# EAGLE design Handy_sense_v_1.0.0 (EAGLE 9.2.0)
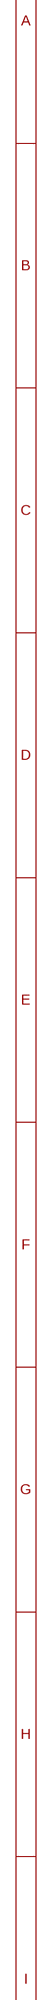
[diagram p0: schematic, sheet 1, part 1 of 2]
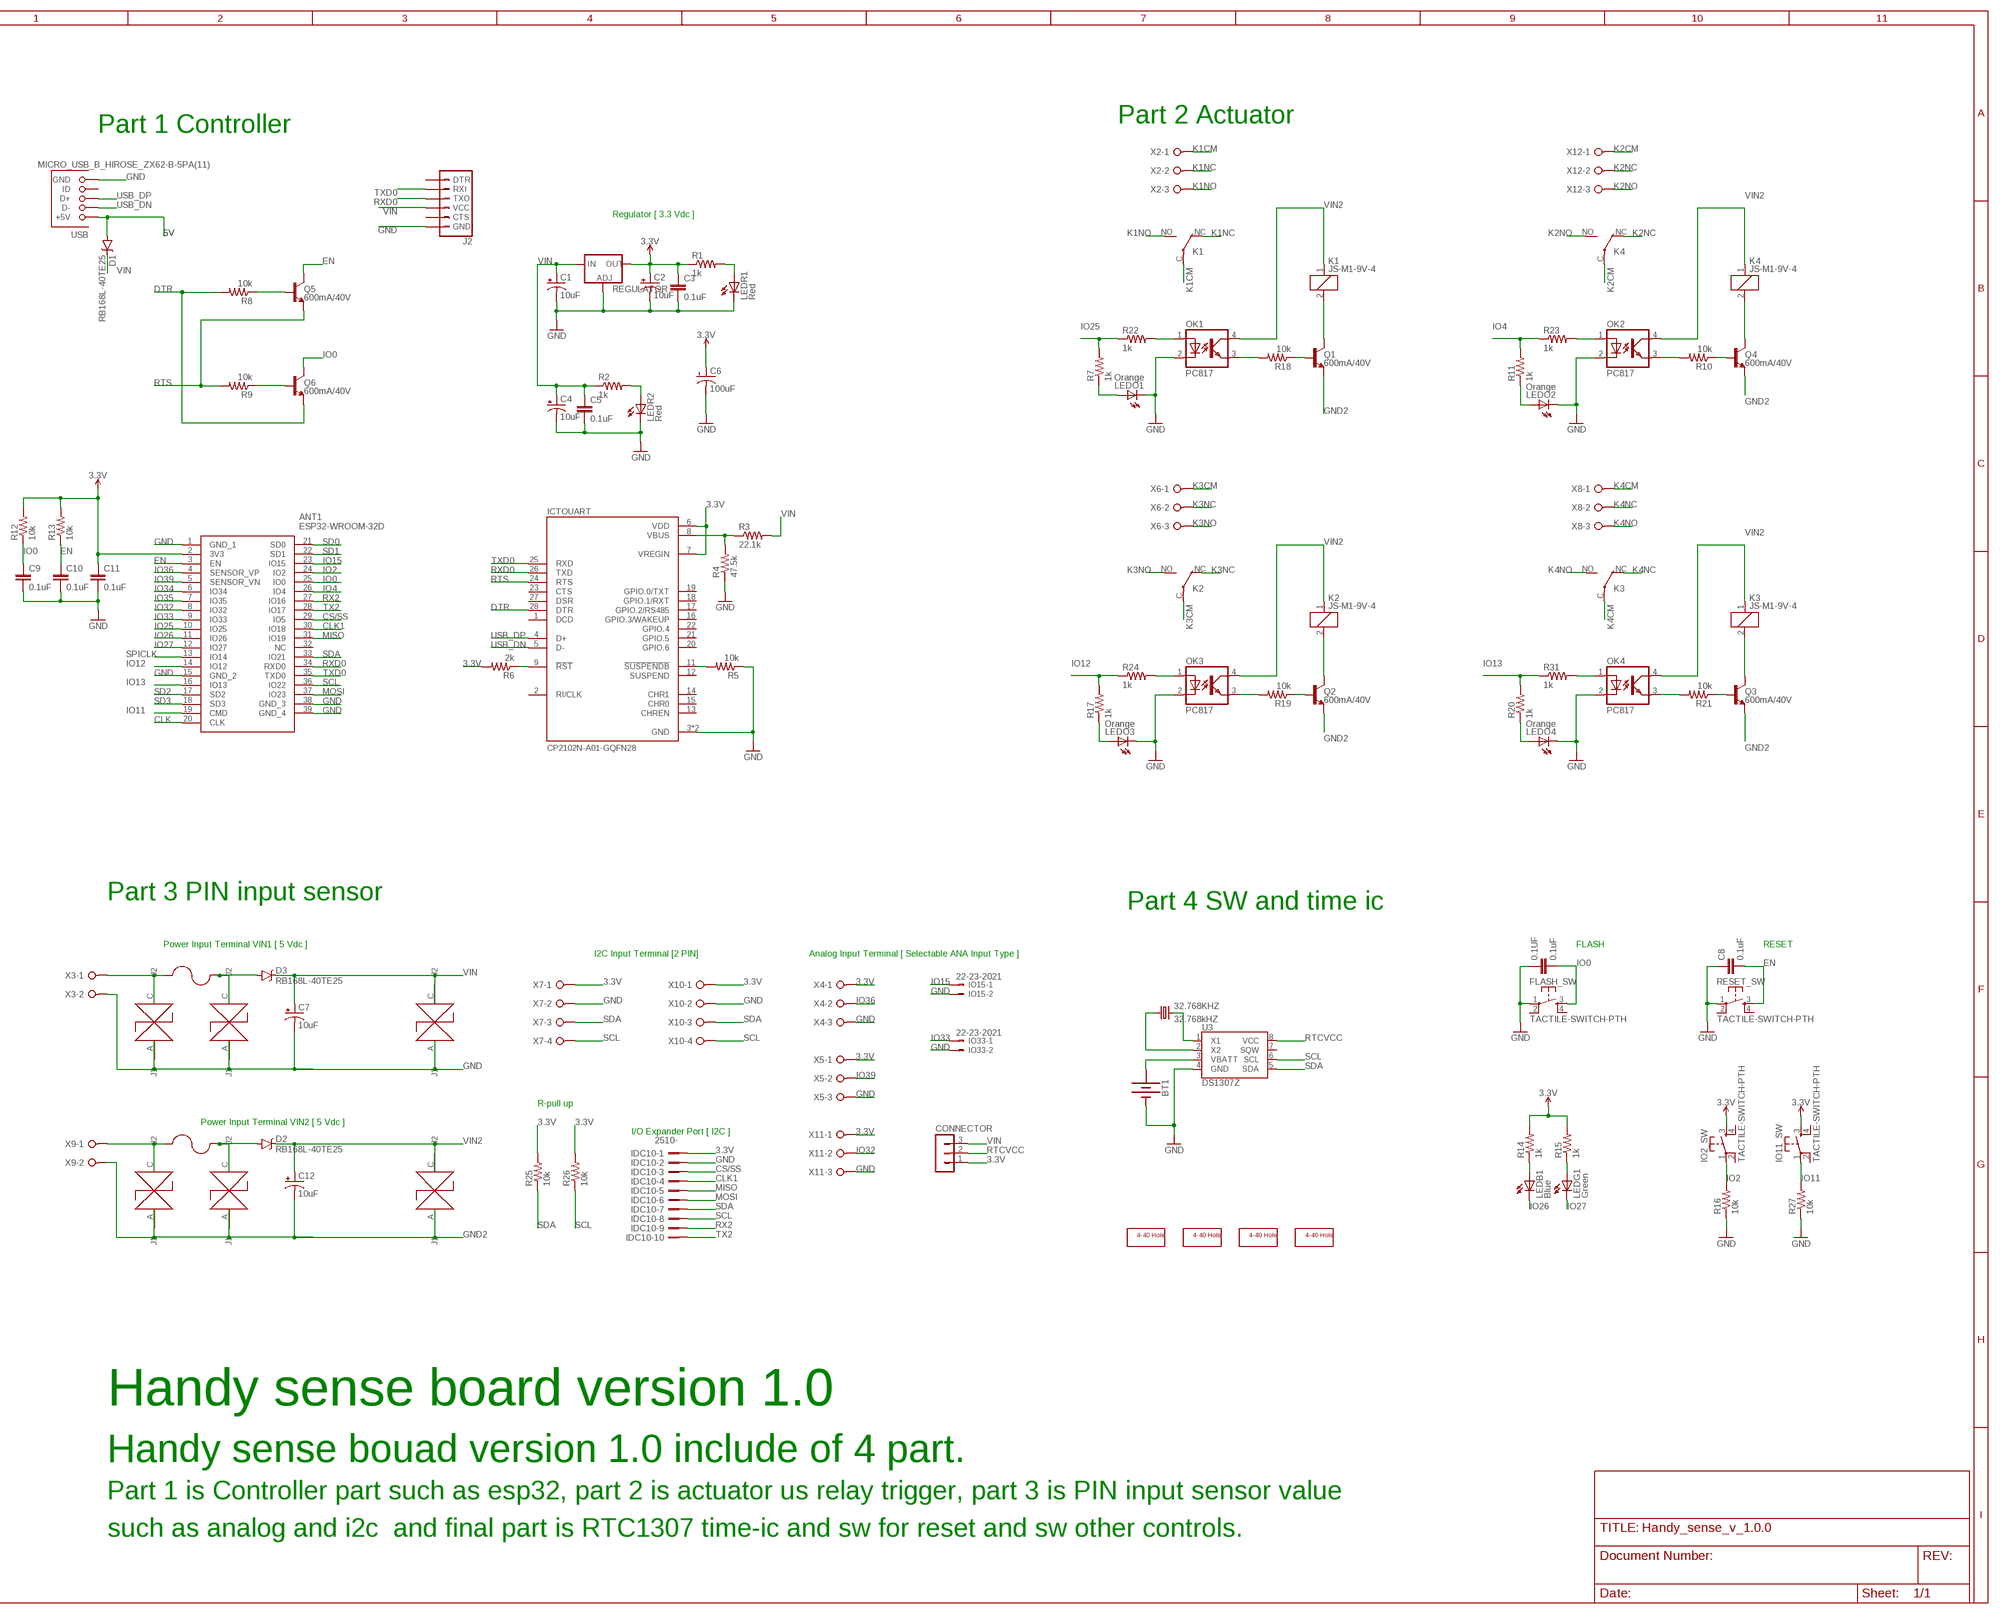
[diagram p1: schematic, sheet 1, part 2 of 2]

## Parts
0.1UF  0.1uF  CAP0805  [0805]
32.768KHZ  32.768kHZ  CRYSTALTC26H  [TC26H]
ANT1  ESP32-WROOM-32D  [ESP32WROOM32D]
BT1  BATTERY-20MM_PTH_KIT  [BATTCOM_20MM_PTH_KIT]
C1  10uF  10UF-16V-10%(TANT)  [EIA3216]
C2  10uF  10UF-16V-10%(TANT)  [EIA3216]
C3  0.1uF  CAP0805  [0805]
C4  10uF  10UF-16V-10%(TANT)  [EIA3216]
C5  0.1uF  CAP0805  [0805]
C6  100uF  100UF-POLAR-EIA7343-16V-10%(TANT)  [EIA7343]
C7  10uF  10UF-16V-10%(TANT)  [EIA3216]
C8  0.1uF  CAP0805  [0805]
C9  0.1uF  CAP0805  [0805]
C10  0.1uF  CAP0805  [0805]
C11  0.1uF  CAP0805  [0805]
C12  10uF  10UF-16V-10%(TANT)  [EIA3216]
CONNECTOR  MA03-1  [MA03-1]
D1  RB168L-40TE25  DIODE-SCHOTTKY-MBRA140  [SMA-DIODE]
D2  RB168L-40TE25  DIODE-SCHOTTKY-MBRA140  [SMA-DIODE]
D3  RB168L-40TE25  DIODE-SCHOTTKY-MBRA140  [SMA-DIODE]
FLASH_SW  TACTILE-SWITCH-PTH  [TAC-SWITCH-PTH]
HOLE0  SCREW_HOLE_4-40  [SCREW_HOLE_4-40]
HOLE1  SCREW_HOLE_4-40  [SCREW_HOLE_4-40]
HOLE2  SCREW_HOLE_4-40  [SCREW_HOLE_4-40]
HOLE3  SCREW_HOLE_4-40  [SCREW_HOLE_4-40]
ICTOUART  CP2102N-A01-GQFN28  [QFN50P500X500X80-29N]
IDC10  2510-  [PAK100/2500-10]
IO2_SW  TACTILE-SWITCH-PTH  [TAC-SWITCH-PTH]
IO11_SW  TACTILE-SWITCH-PTH  [TAC-SWITCH-PTH]
IO15  22-23-2021  [22-23-2021]
IO33  22-23-2021  [22-23-2021]
J2  6_PIN_SERIAL_TARGET_SILK  [1X06]
J28CA1  SMBJ28CA  [DIOM505270X240]
J28CA2  SMBJ28CA  [DIOM505270X240]
J28CA3  SMBJ28CA  [DIOM505270X240]
J28CA4  SMBJ28CA  [DIOM505270X240]
J28CA5  SMBJ28CA  [DIOM505270X240]
J28CA6  SMBJ28CA  [DIOM505270X240]
K1  JS-M1-9V-4  [JS-M]
K2  JS-M1-9V-4  [JS-M]
K3  JS-M1-9V-4  [JS-M]
K4  JS-M1-9V-4  [JS-M]
LEDB1  Blue  LEDCHIPLED_0805  [CHIPLED_0805]
LEDG1  Green  LEDCHIPLED_0805  [CHIPLED_0805]
LEDO1  Orange  LEDCHIPLED_0805  [CHIPLED_0805]
LEDO2  Orange  LEDCHIPLED_0805  [CHIPLED_0805]
LEDO3  Orange  LEDCHIPLED_0805  [CHIPLED_0805]
LEDO4  Orange  LEDCHIPLED_0805  [CHIPLED_0805]
LEDR1  Red  LEDCHIPLED_0805  [CHIPLED_0805]
LEDR2  Red  LEDCHIPLED_0805  [CHIPLED_0805]
OK1  PC817  [DIL04]
OK2  PC817  [DIL04]
OK3  PC817  [DIL04]
OK4  PC817  [DIL04]
Q1  600mA/40V  TRANS_NPN-MMBT2222AL  [SOT23-3]
Q2  600mA/40V  TRANS_NPN-MMBT2222AL  [SOT23-3]
Q3  600mA/40V  TRANS_NPN-MMBT2222AL  [SOT23-3]
Q4  600mA/40V  TRANS_NPN-MMBT2222AL  [SOT23-3]
Q5  600mA/40V  TRANS_NPN-MMBT2222AL  [SOT23-3]
Q6  600mA/40V  TRANS_NPN-MMBT2222AL  [SOT23-3]
R1  1k  R-US_R0805  [R0805]
R2  1k  R-US_R0805  [R0805]
R3  22.1k  R-US_R0805  [R0805]
R4  47.5k  R-US_R0805  [R0805]
R5  10k  R-US_R0805  [R0805]
R6  2k  R-US_R0805  [R0805]
R7  1k  R-US_R0805  [R0805]
R8  10k  R-US_R0805  [R0805]
R9  10k  R-US_R0805  [R0805]
R10  10k  R-US_R0805  [R0805]
R11  1k  R-US_R0805  [R0805]
R12  10k  R-US_R0805  [R0805]
R13  10k  R-US_R0805  [R0805]
R14  1k  R-US_R0805  [R0805]
R15  1k  R-US_R0805  [R0805]
R16  10k  R-US_R0805  [R0805]
R17  1k  R-US_R0805  [R0805]
R18  10k  R-US_R0805  [R0805]
R19  10k  R-US_R0805  [R0805]
R20  1k  R-US_R0805  [R0805]
R21  10k  R-US_R0805  [R0805]
R22  1k  R-US_R0805  [R0805]
R23  1k  R-US_R0805  [R0805]
R24  1k  R-US_R0805  [R0805]
R25  10k  R-US_R0805  [R0805]
R26  10k  R-US_R0805  [R0805]
R27  10k  R-US_R0805  [R0805]
R31  1k  R-US_R0805  [R0805]
REGULATOR  V_REG_LM1117SOT223  [SOT223]
RESET_SW  TACTILE-SWITCH-PTH  [TAC-SWITCH-PTH]
U3  DS1307Z  [SO08-0.15]
U$1  MSMFF2602  [FUSE_MF-MSMF260-2]
U$2  MSMFF2602  [FUSE_MF-MSMF260-2]
USB  MICRO_USB_B_HIROSE_ZX62-B-5PA(11)  [USB_MICRO_B-HIROSE-ZX62-B-5PA(11)]
X2  W237-03P  [W237-133]
X3  W237-02P  [W237-132]
X4  W237-03P  [W237-133]
X5  W237-03P  [W237-133]
X6  W237-03P  [W237-133]
X7  W237-04P  [W237-4P]
X8  W237-03P  [W237-133]
X9  W237-02P  [W237-132]
X10  W237-04P  [W237-4P]
X11  W237-03P  [W237-133]
X12  W237-03P  [W237-133]

## Nets
3.3V [etc]: ANT1.2(3V3) C2.A(+) C3.1 C6.A(+) C11.1 CONNECTOR.1 ICTOUART.6(VDD) ICTOUART.7(VREGIN) IDC10.1 IO2_SW.3 IO11_SW.3 R1.1 R6.2 R12.2 R13.2 R14.2 R15.2 R25.2 R26.2 REGULATOR.2(OUT) REGULATOR.4(OUT) X4.1 X5.1 X7.1 X10.1 X11.1
5V: D1.A USB.1(+5V)
CLK: ANT1.20(CLK)
CLK1 [spi]: ANT1.30(IO18) IDC10.4
CS/SS [spi]: ANT1.29(IO5) IDC10.3
DTR: ICTOUART.28(DTR) Q6.2(E) R8.2
EN: ANT1.3(EN) C8.2 C10.1 Q5.3(C) R13.1 RESET_SW.3
GND [etc]: 0.1UF.1 ANT1.1(GND_1) ANT1.15(GND_2) ANT1.38(GND_3) ANT1.39(GND_4) BT1.2(-) C1.C(-) C2.C(-) C3.2 C4.C(-) C5.2 C6.C(-) C7.C(-) C8.1 C9.2 C10.2 C11.2 FLASH_SW.1 ICTOUART.3(GND) ICTOUART.29(GND) IDC10.2 IO15.2 IO33.2 J2.6(GND) J28CA1.A(J1) J28CA2.A(J1) J28CA3.A(J1) LEDO1.C LEDO2.C LEDO3.C LEDO4.C LEDR1.C LEDR2.C OK1.2(C) OK2.2(C) OK3.2(C) OK4.2(C) R4.1 R5.1 R16.1 R27.1 REGULATOR.1(ADJ) RESET_SW.1 U3.4(GND) USB.5(GND) X3.2 X4.3 X5.3 X7.2 X10.2 X11.3
GND2 [etc]: C12.C(-) J28CA4.A(J1) J28CA5.A(J1) J28CA6.A(J1) Q1.2(E) Q2.2(E) Q3.2(E) Q4.2(E) X9.2
IO0: 0.1UF.2 ANT1.25(IO0) C9.1 FLASH_SW.3 Q6.3(C) R12.1
IO2 [etc]: ANT1.24(IO2) IO2_SW.1 R16.2
IO4: ANT1.26(IO4) R11.2 R23.1
IO11 [etc]: ANT1.19(CMD) IO11_SW.1 R27.2
IO12 [spi]: ANT1.14(IO12) R17.2 R24.1
IO13 [spi]: ANT1.16(IO13) R20.2 R31.1
IO15 [spi]: ANT1.23(IO15) IO15.1
IO25: ANT1.10(IO25) R7.2 R22.1
IO26: ANT1.11(IO26) LEDB1.C
IO27: ANT1.12(IO27) LEDG1.C
IO32: ANT1.8(IO32) X11.2
IO33: ANT1.9(IO33) IO33.1
IO34: ANT1.6(IO34)
IO35: ANT1.7(IO35)
IO36 [etc]: ANT1.4(SENSOR_VP) X4.2
IO39: ANT1.5(SENSOR_VN) X5.2
K1CM: K1.C(2:P) X2.1
K1NC: K1.NC(2:O) X2.2
K1NO: K1.NO(2:S) X2.3
K2CM: K4.C(2:P) X12.1
K2NC: K4.NC(2:O) X12.2
K2NO: K4.NO(2:S) X12.3
K3CM: K2.C(2:P) X6.1
K3NC: K2.NC(2:O) X6.2
K3NO: K2.NO(2:S) X6.3
K4CM: K3.C(2:P) X8.1
K4NC: K3.NC(2:O) X8.2
K4NO: K3.NO(2:S) X8.3
MISO [spi]: ANT1.31(IO19) IDC10.5
MOSI [spi]: ANT1.37(IO23) IDC10.6
N$1: K1.2 Q1.3(C)
N$2: ICTOUART.9(!RST) R6.1
N$3: ICTOUART.8(VBUS) R3.1 R4.2
N$4: LEDR2.A R2.2
N$5: Q4.1(B) R10.1
N$6: ICTOUART.11(!SUSPENDB) R5.2
N$7: Q5.1(B) R8.1
N$8: Q1.1(B) R18.1
N$9: Q2.1(B) R19.1
N$10: Q6.1(B) R9.1
N$11: OK3.3(EMIT) R19.2
N$12: OK1.3(EMIT) R18.2
N$13: 32.768KHZ.2 U3.1(X1)
N$14: LEDB1.A R14.1
N$15: LEDR1.A R1.2
N$16: K2.2 Q2.3(C)
N$17: 32.768KHZ.1 U3.2(X2)
N$18: BT1.1(+) U3.3(VBATT)
N$19: LEDG1.A R15.1
N$20 [IO]: LEDO2.A R11.1
N$21: OK2.3(EMIT) R10.2
N$22 [IO]: LEDO3.A R17.1
N$23: K4.2 Q4.3(C)
N$24: Q3.1(B) R21.1
N$25 [IO]: LEDO4.A R20.1
N$26: OK4.3(EMIT) R21.2
N$27: K3.2 Q3.3(C)
N$28 [5cdv]: J28CA1.C(J2) U$1.1 X3.1
N$29: OK1.1(A) R22.2
N$30: OK3.1(A) R24.2
N$31: OK2.1(A) R23.2
N$32: OK4.1(A) R31.2
N$33 [5cdv]: LEDO1.A R7.1
N$34 [5cdv]: D3.A J28CA2.C(J2) U$1.2
N$35 [5cdv]: J28CA4.C(J2) U$2.1 X9.1
N$37 [5cdv]: D2.A J28CA5.C(J2) U$2.2
RTCVCC [spi]: CONNECTOR.2 U3.8(VCC)
RTS: ICTOUART.24(RTS) Q5.2(E) R9.2
RX2 [spi]: ANT1.27(IO16) IDC10.9
RXD0: ANT1.34(RXD0) ICTOUART.26(TXD) J2.3(TXO)
SCL [etc]: ANT1.36(IO22) IDC10.8 R26.1 U3.6(SCL) X7.4 X10.4
SD0: ANT1.21(SD0)
SD1: ANT1.22(SD1)
SD2: ANT1.17(SD2)
SD3: ANT1.18(SD3)
SDA [etc]: ANT1.33(IO21) IDC10.7 R25.1 U3.5(SDA) X7.3 X10.3
SPICLK: ANT1.13(IO14)
TX2 [spi]: ANT1.28(IO17) IDC10.10
TXD0: ANT1.35(TXD0) ICTOUART.25(RXD) J2.2(RXI)
USB_DN: ICTOUART.5(D-) USB.2(D-)
USB_DP: ICTOUART.4(D+) USB.3(D+)
VIN [spi]: C1.A(+) C4.A(+) C5.1 C7.A(+) CONNECTOR.3 D1.C D3.C J2.4(VCC) J28CA3.C(J2) R2.1 R3.2 REGULATOR.3(IN)
VIN2 [spi]: C12.A(+) D2.C J28CA6.C(J2) K1.1 K2.1 K3.1 K4.1 OK1.4(COL) OK2.4(COL) OK3.4(COL) OK4.4(COL)
Unconnected: ANT1.32(NC) FLASH_SW.2 FLASH_SW.4 ICTOUART.1(DCD) ICTOUART.2(RI/CLK) ICTOUART.12(SUSPEND) ICTOUART.13(CHREN) ICTOUART.14(CHR1) ICTOUART.15(CHR0) ICTOUART.16(GPIO.3/WAKEUP) ICTOUART.17(GPIO.2/RS485) ICTOUART.18(GPIO.1/RXT) ICTOUART.19(GPIO.0/TXT) ICTOUART.20(GPIO.6) ICTOUART.21(GPIO.5) ICTOUART.22(GPIO.4) ICTOUART.23(CTS) ICTOUART.27(DSR) IO2_SW.2 IO2_SW.4 IO11_SW.2 IO11_SW.4 J2.1(DTR) J2.5(CTS) RESET_SW.2 RESET_SW.4 U3.7(SQW) USB.4(ID)

## Notes on the sheet
- Part 2 Actuator
- Part 1 Controller
- Regulator [ 3.3 Vdc ]
- Part 3 PIN input sensor
- Part 4 SW and time ic
- Power Input Terminal VIN1 [ 5 Vdc ] | FLASH | RESET
- I2C Input Terminal [2 PIN] | Analog Input Terminal [ Selectable ANA Input Type ]
- R-pull up
- Power Input Terminal VIN2 [ 5 Vdc ]
- I/O Expander Port [ I2C ]
- Handy sense board version 1.0
- Handy sense bouad version 1.0 include of 4 part.
- Part 1 is Controller part such as esp32, part 2 is actuator us relay trigger, part 3 is PIN input sensor value
- such as analog and i2c  and final part is RTC1307 time-ic and sw for reset and sw other controls.

## Library data of the parts
0.1UF C3 C5 C8-C11 = SparkFun-Capacitors:CAP: Capacitor Standard 0603 ceramic capacitor, and 0.1" leaded capacitor.
32.768KHZ = adafruit:CRYSTAL: CRYSTAL; OC_FARNELL: unknown; OC_NEWARK: unknown
ANT1 = ESP32-WROOM-32D:ESP32-WROOM-32D: WiFi Modules (802.11) SMD Module, ESP32-D0WD, 32Mbits SPI flash, UART mode, PCB antenna Source: Datasheet <https://www.mouser.com/datasheet/2/891/esp32-wroom-32d_esp32-wroom-32u_datasheet_en-1365844.pdf>; DESCRIPTION: WiFi Modules (802.11) SMD Module, ESP32-D0WD, 32Mbits SPI flash, UART mode, PCB antenna; HEIGHT: 3.1mm; MANUFACTURER_NAME: Espressif; MANUFACTURER_PART_NUMBER: ESP32-WROOM-32D; MOUSER_PART_NUMBER: 356-ESP32WROOM-32D; RS_PART_NUMBER: 356-ESP32WROOM-32D
BT1 = SparkFun-Batteries:BATTERY: Battery - Single Cell A variety of battery chemistries, sizes, and footprints. Device List: 20MM_PTH - Coin Cell Battery Holder - 20mm (PTH) <https://www.sparkfun.com/products/783> 20MM_PTH_KIT- Coin Cell battery Holder - 20 mm (PTH) <http://www.sparkfun.com/products/783>kit version with special mask 6.8MM_PTH - Coin Cell Battery Holder - 6.8MM(SMD) <https://www.digikey.com/product-detail/en/seiko-instruments/MS621FE-FL11E/728-1057-ND/1889208?WT.srch=1&gclid=CNOQ5a6LzdQCFZS2wAodXCkE0g> 12MM_SMD - Coin Cell Battery Holder - 12mm (SMD) <https://www.sparkfun.com/products/10592> 12MM_PTH - Coin Cell Battery Holder - 12mm (PTH) <https://www.sparkfun.com/products/7948> 20MM_SMD - 20mm Coin Cell Battery Holder (SMD) (2 legs) Used on the Big Time Watch Kit <https://www.sparkfun.com/products/11734> 20MM_SMD_4LEGS - Coin Cell Battery Holder - 20mm (SMD) <https://www.sparkfun.com/products/11892> 20MM_SMD_4LEGS_OVERPASTE - Coin Cell Battery Holder - 20mm (SMD) <https://www.sparkfun.com/products/11892> (Over-paste on the legs) 24.5MM_PTH - Coin Cell Battery Holder - 24.5mm (PTH) <https://www.sparkfun.com/products/8863> 9V - 9V Battery Holder - PC Mount Used on the SparkFun SparkPunk Sound Kit <https://www.sparkfun.com/products/11177> and SparkFun SparkPunk Sequencer Kit <https://www.sparkfun.com/products/12707> 18650 - Battery Holder - 18650 (PTH) <https://www.sparkfun.com/products/13113> AA - Battery Holder - 1xAA (PTH) <https://www.sparkfun.com/products/7949> AAA - Battery Holder - 1xAAA (PTH) <https://www.sparkfun.com/products/12718> AA_KIT - Battery Holder - 1xAA (PTH) <https://www.sparkfun.com/products/7949> Special kit package - pads only have exposed copper on one side of the board. AAA_KIT - Battery Holder - 1xAAA (PTH) <https://www.sparkfun.com/products/12718> Special kit package - pads only have exposed copper on one side of the board.
C1 C2 C4 C7 C12 = SparkFun-Capacitors:10UF-16V-10%(TANT): CAP-00811 1206/EIA-3216 Tantalum capacitor; PROD_ID: CAP-00811
C6 = SparkFun-Capacitors:100UF-POLAR: 100µF polarized capacitors A capacitor is a passive two-terminal electrical component used to store electrical energy temporarily in an electric field.; PROD_ID: CAP-08702
CONNECTOR = con-lstb:MA03-1: PIN HEADER; OC_FARNELL: unknown; OC_NEWARK: unknown
D1-D3 = SparkFun-DiscreteSemi:DIODE-SCHOTTKY: Schottky diodes in SFE's production catalog BAT20J 1A 23V 0.62Vf RB751 120mA 40V 0.37Vf PMEG4005EJ 0.5A 40V 0.42Vf MBRA140 1A 40V 0.5Vf B340A 3A 40V SMA; PROD_ID: DIO-08053; VALUE: MBRA140
FLASH_SW IO2_SW IO11_SW RESET_SW = GeekAmmo:TACTILE-SWITCH: Tactile Switch 4 Pins, SPST NO
HOLE0 HOLE1-HOLE3 = RHD2000_eval_board:SCREW_HOLE_4-40: Mounting hole
ICTOUART = CP2102N-A01-GQFN28:CP2102N-A01-GQFN28: Ic Bridge Usb To Uart 28qfn Check prices <https://snapeda.com/parts/CP2102N-A01-GQFN28/Silicon%20Labs/view-part/?ref=eda>; AVAILABILITY: Bad; DESCRIPTION: USB Bridge, USB to UART USB 2.0 UART Interface 28-QFN (5x5); MF: Silicon Labs; MP: CP2102N-A01-GQFN28; PACKAGE: QFN-28 Silicon Labs; PRICE: None
IDC10 = con-3m:2510-: 3M (TM) Pak 100 4-Wall Header Source: 3M; MF: 3M; MPN: 2510-6002UB; OC_FARNELL: 9838244; OC_NEWARK: 46F4725
IO15 IO33 = con-molex:22-23-2021: .100" (2.54mm) Center Header - 2 Pin; MF: MOLEX; MPN: 22-23-2021; OC_FARNELL: 1462926; OC_NEWARK: 25C3832
J2 = SparkFun-Connectors:6_PIN_SERIAL_TARGET: 6-pin header connection for use with the "FTDI BASIC" pinout - TARGET SIDE. Also known as "Arduino Serial Program Header". It is used to mate with our FTDI Basic serial programmers using the Arduino IDE. Note, this device has "TARGET" in the name. It is intended to be used on a design that contains a target micro-controller that you wish to program. The "sister" device, named "CABLE" is inteneded to be used on a design that usually lives on the end of your USB cable and prvides the converter chip (FTDI232 or FTDI231x) to commnicate serial RX/TX. You can populate with some of these: Break Away Headers - Straight <https://www.sparkfun.com/products/116> (PRT-00116) For reference (or to suit your programming needs) check out these designs: SparkFun FTDI Basic Breakout - 5V <https://www.sparkfun.com/products/9716> (DEV-09716) SparkFun FTDI Basic Breakout - 3.3V <https://www.sparkfun.com/products/9873> (DEV-09873) SparkFun FTDI SmartBasic <https://www.sparkfun.com/products/12935> (DEV-12935) SparkFun Beefy 3 - FTDI Basic Breakout <https://www.sparkfun.com/products/13746> (DEV-13746)
J28CA1-J28CA6 = DIOM505270X240:SMBJ28CA
K1-K4 = relay:JS-M1*: Automotive Ultra-Miniature Power Relay NAiS Source: http://www.mew-europe.com/.. en_ds_61211_0000.pdf; OC_FARNELL: unknown; OC_NEWARK: unknown
LEDB1 LEDG1 LEDO1-LEDO4 LEDR1 LEDR2 = adafruit:LED: LED OSRAM: - CHIPLED LG R971, LG N971, LY N971, LG Q971, LY Q971, LO R971, LY R971 LH N974, LH R974 LS Q976, LO Q976, LY Q976 LO Q996 - Hyper CHIPLED LW Q18S LB Q993, LB Q99A, LB R99A - SideLED LS A670, LO A670, LY A670, LG A670, LP A670 LB A673, LV A673, LT A673, LW A673 LH A674 LY A675 LS A676, LA A676, LO A676, LY A676, LW A676 LS A679, LY A679, LG A679 - Hyper Micro SIDELED® LS Y876, LA Y876, LO Y876, LY Y876 LT Y87S - SmartLED LW L88C, LW L88S LB L89C, LB L89S, LG L890 LS L89K, LO L89K, LY L89K LS L896, LA L896, LO L896, LY L896 - TOPLED LS T670, LO T670, LY T670, LG T670, LP T670 LSG T670, LSP T670, LSY T670, LOP T670, LYG T670 LG T671, LOG T671, LSG T671 LB T673, LV T673, LT T673, LW T673 LH T674 LS T676, LA T676, LO T676, LY T676, LB T676, LH T676, LSB T676, LW T676 LB T67C, LV T67C, LT T67C, LS T67K, LO T67K, LY T67K, LW E67C LS E67B, LA E67B, LO E67B, LY E67B, LB E67C, LV E67C, LT E67C LW T67C LS T679, LY T679, LG T679 LS T770, LO T770, LY T770, LG T770, LP T770 LB T773, LV T773, LT T773, LW T773 LH T774 LS E675, LA E675, LY E675, LS T675 LS T776, LA T776, LO T776, LY T776, LB T776 LHGB T686 LT T68C, LB T68C - Hyper Mini TOPLED® LB M676 - Mini TOPLED Santana® LG M470 LS M47K, LO M47K, LY M47K Source: http://www.osram.convergy.de/
OK1-OK4 = optocoupler:PC817: SHARP OPTO COUPLER; MPN: PC817X4J000F; OC_FARNELL: 9707727; OC_NEWARK: 97K7059
Q1-Q6 = SparkFun-DiscreteSemi:TRANS_NPN: NPN transistor Current controlled devices typically used to amplify current or used as a switch. BC547 - COM-08928 <http://www.sparkfun.com/products/8928> (TO-92 45V 100mA) (1.Collector 2.Base 3.Emitter) 2N3904 - COM-00521 <http://www.sparkfun.com/products/521> (TO-92 40V 200mA) (1.Emitter 2.Base 3.Collector) P2N2222A - COM-12852 <http://www.sparkfun.com/products/12852> (TO-92 40V 600mA) (1.Collector 2.Base 3.Emitter); PROD_ID: TRANS-08049
R1-R27 R31 = adafruit:R-US_: RESISTOR, American symbol
REGULATOR = SparkFun-IC-Power:V_REG_LM1117: Voltage Regulator LM1117 Standard adjustable voltage regulator but in SMD form. Spark Fun Electronics SKU : COM-00595; PROD_ID: VREG-08170
U3 = SparkFun-Clocks:DS1307: Maxim DS1307 - I2C Real-time clock (RTC) The DS1307 serial real-time clock (RTC) is a low-power, full binary-coded decimal (BCD) clock/calendar plus 56 bytes of NV SRAM. Address and data are transferred serially through an I2C, bidirectional bus. The clock/calendar provides seconds, minutes, hours, day, date, month, and year information. SparkFun Products: Real Time Clock Module <https://www.sparkfun.com/products/12708> (BOB-12708) Datasheet <https://cdn.sparkfun.com/datasheets/BreakoutBoards/DS1307.pdf>; PROD_ID: IC-08138
U$1 U$2 = FUSE_MF-MSMF260-2:MSMFF2602: fuse
USB = connector:MICRO_USB_B_HIROSE_ZX62-B-5PA(11): Connector Receptacle USB - micro B 2.0 5 Position Surface Mount, Right Angle, Horizontal Bottom Mount; DIGIKEY: H11634CT-ND; MOUSER: 798-ZX62-B-5PA11; NEWARK: 86P8793
X2 X4-X6 X8 X11 X12 = con-wago-508:W237-03P: WAGO SREW CLAMP; OC_FARNELL: unknown; OC_NEWARK: unknown
X3 X9 = con-wago-508:W237-02P: WAGO SREW CLAMP; OC_FARNELL: unknown; OC_NEWARK: unknown
X7 X10 = con-wago-508:W237-04P: WAGO SREW CLAMP; OC_FARNELL: unknown; OC_NEWARK: unknown

## Net classes
1 5cdv: width 0.61 mm
2 etc: width 0.305 mm
3 IO: width 0.762 mm
4 spi: width 0.406 mm

## Board
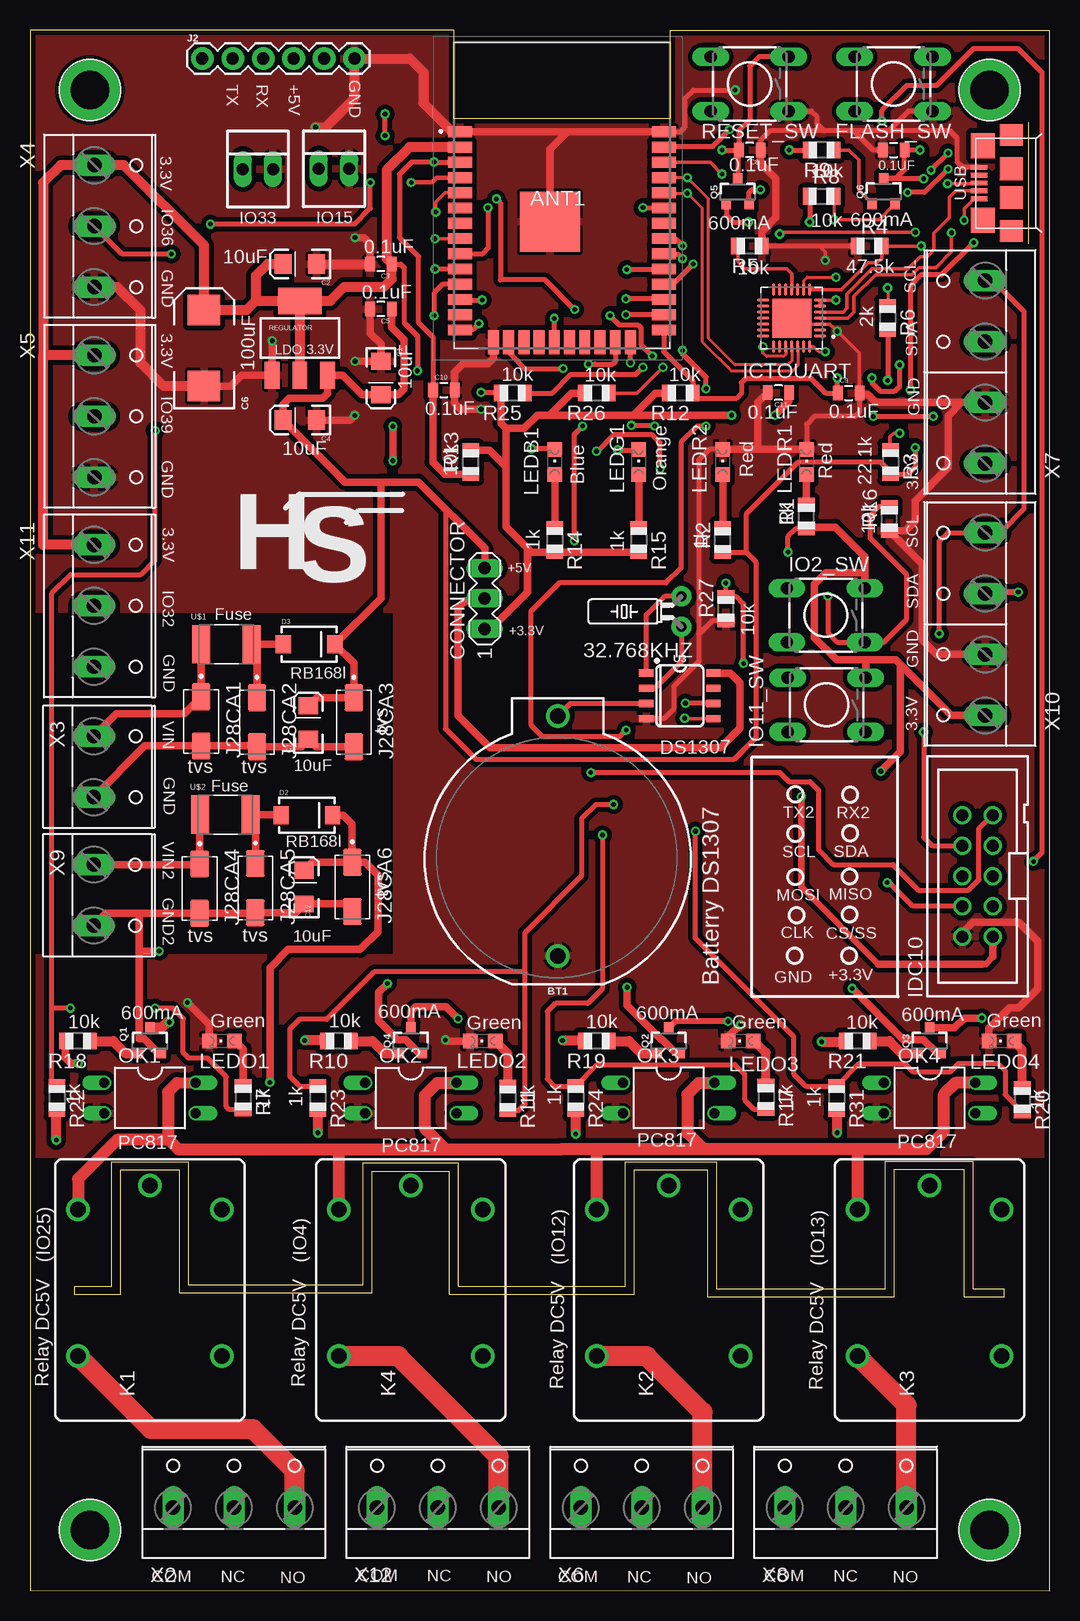
[diagram p2: board, top side]
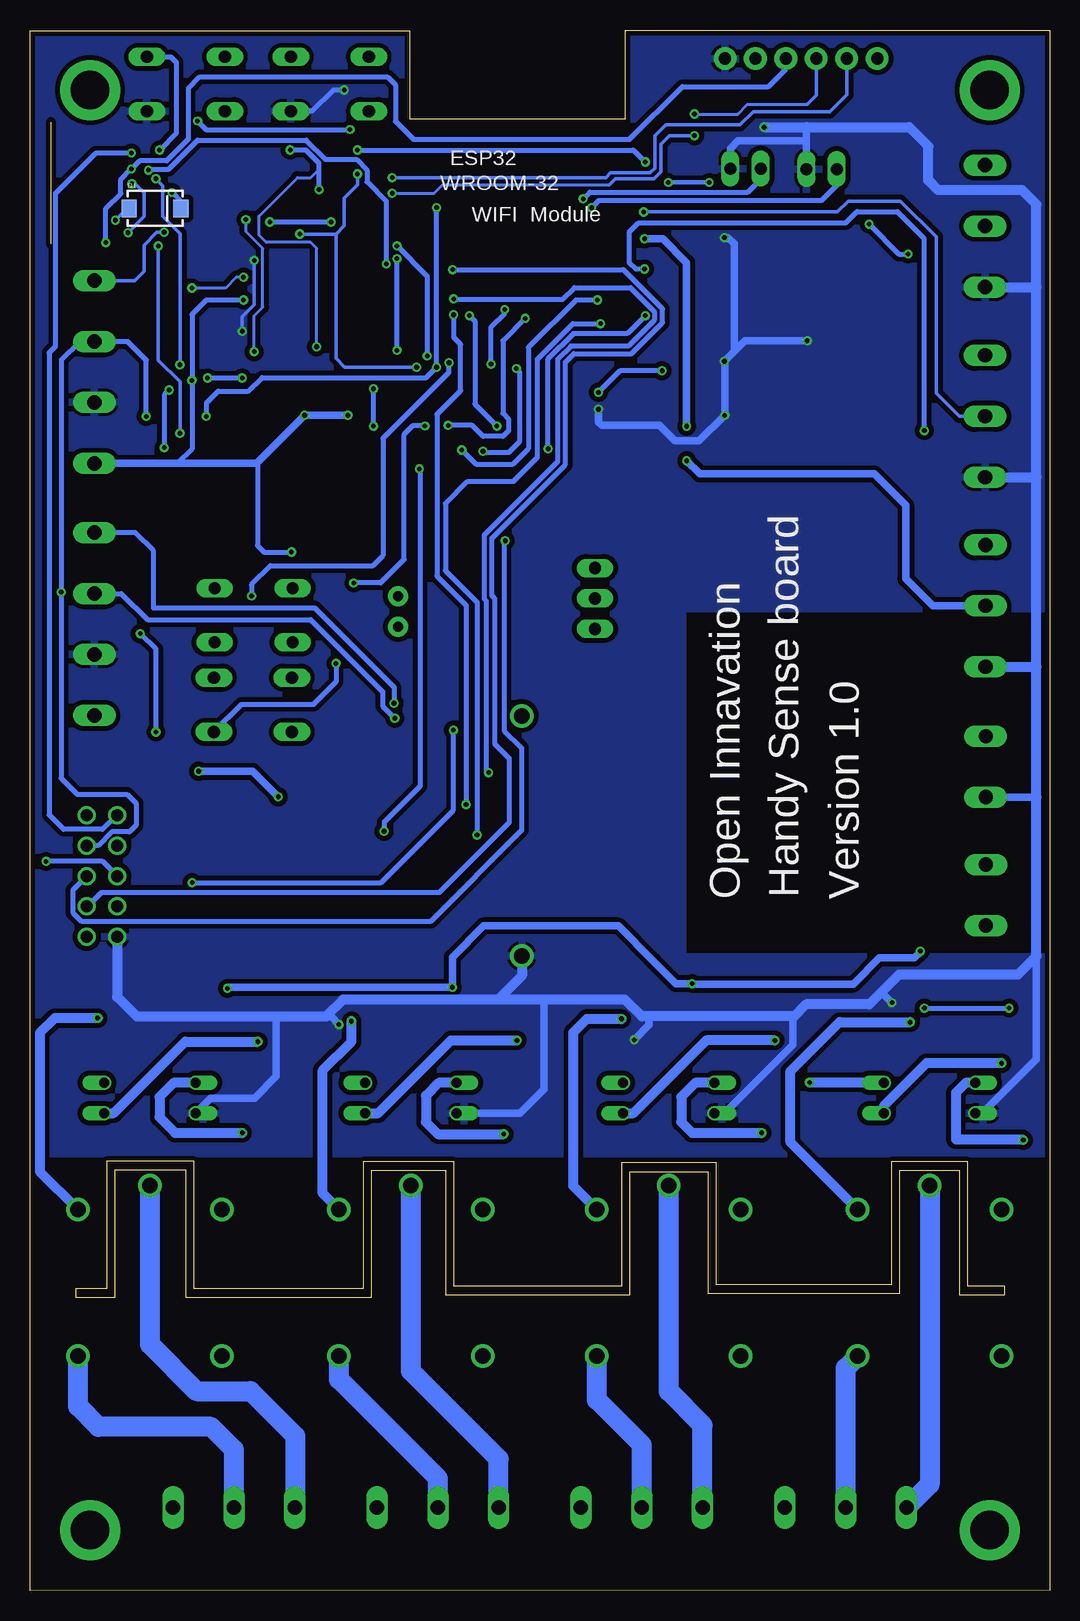
[diagram p3: board, bottom side, seen from below]

Size 85 x 130.05 mm. Coordinates in mm from the lower left corner, seen from the top.
Outline: 0,0.05 85,0 85,130 53.37,130 53.37,122.66 35.36,122.66 35.36,130.05 35.35,130.05 0,130.05 0,0.05
Outline: 7.52,24.66 3.73,24.66 3.73,25.37 6.81,25.37 6.81,35.74 13.21,35.74 13.21,25.48 27.79,25.48 27.79,35.64 35.69,35.64 35.69,25.35 49.66,25.35 49.66,35.74 57.23,35.74 57.23,25.17 71.3,25.15 71.3,35.76 78.61,35.76 78.61,25.15 81.18,25.15 81.18,24.43 77.9,24.43 77.9,35.05 72.01,35.05 72.01,24.43 56.54,24.43 56.52,24.46 56.52,35.03 50.37,35.03 50.37,24.64 34.98,24.64 34.98,34.92 28.5,34.92 28.5,24.76 12.5,24.76 12.5,35.03 7.52,35.03 7.52,24.66
Copper layers (1*16): Top 0.035mm / dielectric 1.5mm / Bottom 0.035mm
Design rules "SparkFun-2-layer-TIGHT *": minimum track width 7mil, minimum drill 15mil, track to track 7mil, track to pad 7mil, pad to pad 7mil, via to via 7mil, smd to smd 7mil, copper to edge 7mil, drill to drill 7mil, minimum pad ring 7mil, minimum via ring 7mil, stop-mask expansion 4mil, vias tented up to drill 25mil, thermal gap 10mil

### Footprints (pad centres in the part's own frame; a part is rotated, then mirrored left to right if it is on the bottom)
0805 = smd 0.8 x 1.2: 1 -0.9,0; 2 0.9,0
TC26H = drill 0.813 pad 1.676: 1 -1.27,0; 2 1.27,0
ESP32WROOM32D = smd 2 x 0.9: 1 -8.15,5.51; 2 -8.15,4.24; 3 -8.15,2.97; 4 -8.15,1.7; 5 -8.15,0.43; 6 -8.15,-0.84; 7 -8.15,-2.11; 8 -8.15,-3.38; 9 -8.15,-4.65; 10 -8.15,-5.92; 11 -8.15,-7.19; 12 -8.15,-8.46; 13 -8.15,-9.73; 14 -8.15,-11; 25 8.85,-11; 26 8.85,-9.73; 27 8.85,-8.46; 28 8.85,-7.19; 29 8.85,-5.92; 30 8.85,-4.65; 31 8.85,-3.38; 32 8.85,-2.11; 33 8.85,-0.84; 34 8.85,0.43; 35 8.85,1.7; 36 8.85,2.97; 37 8.85,4.24; 38 8.85,5.51 | smd 0.9 x 2: 15 -5.365,-12; 16 -4.095,-12; 17 -2.825,-12; 18 -1.555,-12; 19 -0.285,-12; 20 0.985,-12; 21 2.255,-12; 22 3.525,-12; 23 4.795,-12; 24 6.065,-12 | smd 5 x 5: 39 -0.65,-1.99
BATTCOM_20MM_PTH_KIT = drill 1.3: 1 11.85,0; 2 -8.15,0
EIA3216 = smd 1.4 x 1.6: A 1.4,0; C -1.4,0
EIA7343 = smd 2.55 x 2.7: A 3.17,0; C -3.17,0
MA03-1 = drill 1.016 long: 1 -2.54,0; 2 0,0; 3 2.54,0
SMA-DIODE = smd 1.27 x 1.47: A -2.15,0; C 2.15,0
TAC-SWITCH-PTH = drill 1.016 pad 1.524 long: 1 -3.251,2.261; 2 3.251,2.261; 3 -3.251,-2.261; 4 3.251,-2.261
SCREW_HOLE_4-40 = drill 3.2 pad 5: 1 0,0
QFN50P500X500X80-29N = smd 1.01 x 0.27: 1 -2.36,1.5; 2 -2.36,1; 3 -2.36,0.5; 4 -2.36,0; 5 -2.36,-0.5; 6 -2.36,-1; 7 -2.36,-1.5; 15 2.36,-1.5; 16 2.36,-1; 17 2.36,-0.5; 18 2.36,0; 19 2.36,0.5; 20 2.36,1; 21 2.36,1.5 | smd 0.27 x 1.01: 8 -1.5,-2.36; 9 -1,-2.36; 10 -0.5,-2.36; 11 0,-2.36; 12 0.5,-2.36; 13 1,-2.36; 14 1.5,-2.36; 22 1.5,2.36; 23 1,2.36; 24 0.5,2.36; 25 0,2.36; 26 -0.5,2.36; 27 -1,2.36; 28 -1.5,2.36 | smd 3.25 x 3.25: 29 0,0
PAK100/2500-10 = drill 1 pad 1.422: 1 -5.08,-1.27; 2 -5.08,1.27; 3 -2.54,-1.27; 4 -2.54,1.27; 5 0,-1.27; 6 0,1.27; 7 2.54,-1.27; 8 2.54,1.27; 9 5.08,-1.27; 10 5.08,1.27
22-23-2021 = drill 1 long: 1 -1.27,0; 2 1.27,0
1X06 = drill 1.016 pad 1.88: 1 0,0; 2 2.54,0; 3 5.08,0; 4 7.62,0; 5 10.16,0; 6 12.7,0
DIOM505270X240 = smd 2.21 x 1.53: A 2.05,0; C -2.05,0
JS-M = drill 1.3: 1 6.7,6; 2 6.7,-6; C 8.7,0; NC -5.5,-6; NO -5.5,6
CHIPLED_0805 = smd 1.2 x 1.2: A 0,-1.05; C 0,1.05
DIL04 = drill 0.813 offset: 1 -1.27,-3.81; 2 1.27,-3.81; 3 1.27,3.81; 4 -1.27,3.81
SOT23-3 = smd 0.8 x 0.9: 1 -0.95,-1; 2 0.95,-1; 3 0,1.1
R0805 = smd 1.1 x 1.4: 1 -1,0; 2 1,0
SOT223 = smd 1.219 x 2.235: 1 -2.311,-3.099; 2 0,-3.099; 3 2.311,-3.099 | smd 3.6 x 2.2: 4 0,3.099
SO08-0.15 = smd 0.6 x 1.2: 1 -1.905,-2.8; 2 -0.635,-2.8; 3 0.635,-2.8; 4 1.905,-2.8; 5 1.905,2.8; 6 0.635,2.8; 7 -0.635,2.8; 8 -1.905,2.8
FUSE_MF-MSMF260-2 = smd 1.5 x 3.2: 1 -2.1,0; 2 2.1,0
USB_MICRO_B-HIROSE-ZX62-B-5PA(11) = smd 0.4 x 1.35: 1 -1.3,4.125; 2 -0.65,4.125; 3 0,4.125; 4 0.65,4.125; 5 1.3,4.125 | smd 2.1 x 2: P$1 3.1,3.8; P$2 -3.1,3.8 | smd 1.8 x 1.9: P$3 -4,1.45; P$6 4,1.45 | smd 1.9 x 1.9: P$4 -1.2,1.45; P$5 1.2,1.45
W237-133 = drill 1.194 long: 1 -5.08,-0.635; 2 0,-0.635; 3 5.08,-0.635
W237-132 = drill 1.194 long: 1 -2.54,-0.635; 2 2.54,-0.635
W237-4P = drill 1.194 long: 1 -7.62,-0.635; 2 -2.54,-0.635; 3 2.54,-0.635; 4 7.62,-0.635

### Placement (x,y rotation side)
0.1UF  72,120.05 0 top
32.768KHZ  54.31,81.59 90 top
ANT1  44,116.05 0 top
BT1  44,61.05 90 top
C1  29.25,101.05 270 top
C2  22.5,110.55 180 top
C3  29.25,110.55 180 top
C4  22.5,97.55 180 top
C5  29.25,106.8 180 top
C6  14.5,103.55 90 top
C7  23.22,72.34 90 top
C8  60,120.05 180 top
C9  68.25,99.8 0 top
C10  34.5,100.05 0 top
C11  62.39,99.83 180 top
C12  22.86,58.62 90 top
CONNECTOR  37.9,82.68 90 top
D1  74.57,115.19 0 bottom
D2  23.09,64.62 0 top
D3  23.27,78.87 0 top
FLASH_SW  72,125.55 180 top
HOLE0  80,125.05 0 top
HOLE1  5,125.05 0 top
HOLE2  80,5.05 0 top
HOLE3  5,5.05 0 top
ICTOUART  63.5,106.05 180 top
IDC10  79,59.55 90 top
IO2_SW  66.36,81.28 180 top
IO11_SW  66.42,73.81 180 top
IO15  25.35,118.49 0 top
IO33  19,118.47 0 top
J2  14.36,127.67 0 top
J28CA1  14.27,72.44 270 top
J28CA2  18.92,72.36 270 top
J28CA3  27,72.36 270 top
J28CA4  14.15,58.5 270 top
J28CA5  18.8,58.55 270 top
J28CA6  26.87,58.65 270 top
K1  10,25.05 90 top
K2  53.25,25.05 90 top
K3  75,25.05 90 top
K4  31.75,25.05 90 top
LEDB1  43.75,94.05 0 top
LEDG1  50.75,94.05 0 top
LEDO1  16,45.8 90 top
LEDO2  37.75,45.8 90 top
LEDO3  59.25,45.8 90 top
LEDO4  81,45.8 90 top
LEDR1  64.75,94.05 0 top
LEDR2  57.75,94.05 0 top
OK1  10,41.05 270 top
OK2  31.75,41.05 270 top
OK3  53.25,41.05 270 top
OK4  75,41.05 270 top
Q1  10,45.8 0 top
Q2  53.25,45.8 0 top
Q3  75,45.8 0 top
Q4  31.75,45.8 0 top
Q5  59,116.55 0 top
Q6  71.17,116.58 0 top
R1  64.72,89.51 90 top
R2  57.75,87.55 90 top
R3  71.75,94.05 270 top
R4  70,112.05 0 top
R5  60,112.05 180 top
R6  71.5,106.05 270 top
R7  17.78,41.07 270 top
R8  66,116.2 0 top
R9  66,120.05 180 top
R10  25.75,45.8 180 top
R11  39.83,41.02 270 top
R12  54.25,99.8 180 top
R13  36.75,94.05 90 top
R14  43.75,87.55 270 top
R15  50.75,87.55 270 top
R16  71.65,89.3 90 top
R17  61.37,41.12 270 top
R18  4,45.8 180 top
R19  47.25,45.8 180 top
R20  82.73,40.89 270 top
R21  69,45.8 180 top
R22  2.25,41.05 270 top
R23  24,41.05 270 top
R24  45.5,41.05 270 top
R25  40.25,99.8 180 top
R26  47.25,99.8 180 top
R27  58.01,81.81 90 top
R31  67.25,41.05 270 top
REGULATOR  22.5,104.38 0 top
RESET_SW  60,125.55 180 top
U3  54.18,74.56 270 top
U$1  16.38,78.87 0 top
U$2  16.31,64.67 0 top
USB  83.25,117.3 90 top
X2  17,7.55 0 top
X3  5.95,68.66 270 top
X4  6,113.71 270 top
X5  6,97.86 270 top
X6  51,7.55 0 top
X7  79,101.55 90 top
X8  68,7.55 0 top
X9  5.94,57.96 270 top
X10  79,80.55 90 top
X11  5.97,82.07 270 top
X12  34,7.55 0 top

### Tracks (layer width: path | path; a pad name or v marks a point on that pad's centre or on a via)
3.3V  (via drill 0.4)
  Top 0.305: v67.2,107.55 ICTOUART.7 ICTOUART.6
  Top 0.406: v32.3,101.65 32.3,104.55 31.2,105.65 31.2,110.25 30.9,110.55 C3.1 30.18,110.58 | v37.6,99.85 39.2,99.85 R25.2 | R6.2 v71.5,100.85 | v63.2,86.55 63.2,87.85 63.86,88.51 R1.1
  Top 0.559: 80.27,52.81 79.67,52.21 79.38,52.21 | 70.74,52.21 64.3,58.65 v64.3,66.15
  Top 0.61: R15.2 R14.2 41.8,86.55 41.49,86.86 | 39.7,96.85 39.7,93.65 | 39.7,93.65 39.7,88.65 41.49,86.86 | R25.2 39.25,97.3 39.7,96.85 | R13.2 38.3,95.05 39.7,93.65 | IDC10.1 80.27,52.81 | 79.38,52.21 70.74,52.21 | R1.1 64.85,88.63 67.13,88.63 69.61,86.15 69.61,84.78 | C11.1 63.27,99.8 63.27,99.12 v62.1,97.95 | v58.5,97.95 50.3,97.95 | 50.3,97.95 43.3,97.95 | 43.3,97.95 42.3,97.95 41.2,96.85 39.7,96.85 | R26.2 45.15,99.8 43.3,97.95 | R12.2 52.15,99.8 50.3,97.95 | CONNECTOR.1 38.46,80.14 41.49,83.18 41.49,86.86 | 69.61,84.78 IO2_SW.3 | X10.1 76.83,72.93 72.57,77.19 | 69.7,77.57 72.19,77.57 72.57,77.19 | 69.7,77.57 67.25,77.57 65.41,79.42 65.41,83.87 66.37,84.84 69.56,84.84 69.61,84.78 | v70.93,68.28 72.57,69.92 72.57,77.19 | 69.7,77.57 69.7,76.1 IO11_SW.3
  Top 0.813: 14.38,106.72 C6.A | C6.A 18.07,106.72 18.83,107.48 | 18.83,107.48 REGULATOR.4 | REGULATOR.2 REGULATOR.4 | REGULATOR.4 25.03,107.48 26.2,108.65 29.5,108.65 30.15,109.3 C3.1 | C2.A 19.8,110.55 18.83,109.58 18.83,107.48 | 1.1,102.94 1.1,87.15 X11.1 | 1.1,102.94 1.1,117.34 2.55,118.79 X4.1 7.83,118.79 14.5,112.12 C6.A | X5.1 1.1,102.94 | ANT1.2 31.64,120.29 29.74,118.39 29.74,111.01 30.18,110.58
  Bottom 0.406: 72.7,93.93 71.5,95.13 v71.5,100.85 71.5,106.35 70.3,107.55 v67.2,107.55 | 66.03,94.02 66.03,87.08 65.5,86.55 v63.2,86.55 | v32.3,101.65 35.8,101.65 v37.6,99.85
  Bottom 0.61: v70.93,68.28 66.43,68.28 v64.3,66.15 | v58.5,97.95 v62.1,97.95 66.03,94.02 66.12,93.93 72.7,93.93 X7.1
5V  (via drill 0.38)
  Top 0.305: v77.88,114.2 77.88,115.14 78.73,116 USB.1
  Bottom 0.305: v77.88,114.2 76.89,115.19 D1.A
CLK1  (via drill 0.38)
  Top 0.406: 52.9,111.35 54.05,111.35 v54.41,111 | v54.41,103.35 54.41,103.09 56.36,101.13 v56.36,100.15 | v49.7,71.7 49.16,71.17 42.75,71.17 41.74,72.17 41.74,81.57 44.15,83.97 53.03,83.97 54.28,85.22 54.28,95.68 55.64,97.04 v56.36,97.04 | v71.48,58.99 71.65,58.99 73.61,57.04 77.7,57.04
  Top 0.61: ANT1.30 52.9,111.36 52.9,111.35 | IDC10.4 77.7,57.04
  Bottom 0.406: v54.41,103.35 v54.41,111 | v56.36,97.04 v56.36,100.15 | v49.7,71.7 49.7,65.04 55.74,58.99 v71.48,58.99
CS/SS  (via drill 0.38)
  Top 0.406: 52.81,110.11 52.78,110.08 v49.76,110.08
  Top 0.61: ANT1.29 52.83,110.11 52.81,110.11
  Bottom 0.406: v49.76,110.08 35.53,110.08 32.27,106.82 32.27,105.66 34.85,103.09 39.65,103.09 40.36,102.37 40.36,93.84 46.49,87.71 46.49,82.91 46.27,82.68 46.27,70.59 45.05,69.37 45.05,63.99 50.85,58.19 79.03,58.19 80.19,57.04 IDC10.3
DTR  (via drill 0.4)
  Top 0.254: ICTOUART.28 65.3,103.69 65.74,103.25 v66.3,103.25 | R8.2 v67,114.25
  Top 0.305: v67,114.25 70.8,114.25 Q6.2
  Bottom 0.254: v66.3,103.25 66.3,106.25 65.6,106.95 65.6,111.85 67,113.25 v67,114.25
EN  (via drill 0.4)
  Top 0.254: ANT1.3 35.88,119.05
  Top 0.406: RESET_SW.3 60.76,127.81 60,127.05 60,122.55 59.1,121.65 C8.2 | C8.2 59,119.95 Q5.3 | C10.1 33.6,104.45 32.4,105.65 32.4,111.16 30.81,112.75 30.81,118.03 31.83,119.05 v33.7,119.05 35.82,119.05 ANT1.3 | v57.7,120.05 C8.2
  Top 0.61: C10.1 33.6,94.05 34.6,93.05 R13.1
  Bottom 0.406: v57.7,120.05 34.7,120.05 v33.7,119.05
GND  (via drill 0.38, 0.4)
  Top 0.305: ICTOUART.29 64,105.55 ICTOUART.3 66.7,105.55 v67.3,104.95 69.15,103.1 C9.2 | v66.3,110.85 66.3,111.55 65.8,112.05
  Top 0.406: USB.5 77.75,118.6 77.3,119.05 77.3,121.05 76.7,121.65 71.6,121.65 | 71.6,121.65 68.7,121.65 | 68.7,121.65 66.2,121.65 | 66.2,121.65 61.7,121.65 60.9,120.85 C8.1 | RESET_SW.1 65.16,123.29 65.6,122.85 65.6,122.25 66.2,121.65 | 0.1UF.1 70.3,120.05 68.7,121.65 | FLASH_SW.1 73.24,123.29 71.6,121.65 | LEDR2.C 56.65,95.1 55.77,94.22 55.77,79.7 | 55.77,79.7 55.77,77.44 53.67,75.35 53.67,73.48 52.84,72.66 U3.4 | R4.1 65.8,112.05 R5.1 | ANT1.38 54.21,121.56 54.6,121.95 54.6,124.35 55.3,125.05 v58.8,125.05 | C9.2 69.15,98.2 68.8,97.85 65.4,97.85 64.75,97.2 LEDR1.C | 76.57,97.92 77.5,98.85 77.5,99.01 | R27.1 56.88,80.81 55.77,79.7
  Top 0.61: LEDR2.C 60.71,95.1 | C11.2 60.71,99.04 60.71,95.1 | C6.C 14.53,100.35 | C5.2 28.35,104.8 29.25,103.9 C1.C v27.1,102.45 | C8.1 60.9,118.95 62.2,117.65 62.2,114.45 61,113.25 R5.1 | C6.C 13.62,100.38 | ANT1.38 44.8,121.56 | 44.8,121.56 ANT1.1 | ANT1.39 43.35,120.11 44.8,121.56 | v27.1,112.75 27.84,112.75 28.35,112.24 C3.2 | C9.2 69.3,99.65 69.85,99.65 70.49,99.01 77.5,99.01 X7.2 77.66,99.01 76.57,97.92 76.57,93.6 73.81,90.84 73.81,89.14 72.97,88.3 R16.1 74.41,85.54 74.41,79.19 75.62,77.98 75.65,78.01 X10.2 | C6.C 16.73,100.38 17.63,101.28 REGULATOR.1 20.19,104.14 v20.2,104.15 | LEDO4.C 79.95,46.85 81.68,48.58 82.45,48.58 84.02,50.15 84.02,54.12 82.43,55.7 78.59,55.7 77.73,54.84 IDC10.2 | C4.C 26.68,97.55 v27.08,97.94 | 60.71,95.1 LEDR1.C | LEDO2.C 34.72,45.8 v34.62,45.9 | LEDO3.C 58.2,46.13 v59.23,47.17 | LEDO1.C 14.95,47.18 v13.13,49 | v37.6,98.45 35.9,98.45 35.4,98.95 C10.2 35.4,101.55 36.1,102.25 38.2,102.25 38.63,102.69 ANT1.15 | 14.28,70.38 J28CA1.A | X3.2 9.58,70.39 J28CA1.A | J28CA1.A 18.85,70.39 J28CA2.A 22.59,70.31 C7.C 23.84,70.31 J28CA3.A
  Top 0.813: C2.C C3.2 | v23.8,121.95 24.64,121.95 27.06,124.37 J2.6 31.68,127.67 32.8,126.55 32.8,123.95 35.19,121.56 ANT1.1 | C6.C 11.15,100.38 9.22,102.31 9.22,106.68 7.27,108.63 X4.3
  Bottom 0.305: v67.3,104.95 67.3,106.15 66.3,107.15 v66.3,110.85
  Bottom 0.406: v58.8,125.05 59.7,125.05 61.46,123.29 RESET_SW.1
  Bottom 0.61: v27.1,102.45 26.29,103.26 26.29,112.24 26.8,112.75 v27.1,112.75 | v37.6,98.45 37.6,97.38 37.32,97.1 32.53,97.1 31.24,95.81 29.21,95.81 v27.08,97.94 27.08,102.43 v27.1,102.45 | v20.2,104.15 25.4,104.15 v27.1,102.45 | v34.62,45.9 33.38,47.14 33.38,47.85 | v13.13,49 14.01,49.87 | 1.1,52.86 1.1,44.29 5.61,39.78 OK1.2 | 21.4,47.75 21.4,45.5 27.12,39.78 OK2.2 | OK3.2 44.13,39.78 42.14,41.77 42.14,49.25 | OK4.2 69.92,41.05 66.28,41.05 64.47,42.86 64.47,47.85 | v59.23,47.17 59.92,47.85 60.3,47.85 | IO33.2 20.27,120.88 | 20.27,120.88 20.27,121.95 | IO15.2 26.62,120.17 25.98,120.8 20.34,120.8 20.27,120.88 | 6.15,76.99 X11.3 | X3.2 1.12,66.12 1.1,66.14
  Bottom 0.813: IDC10.2 77.73,49.48 76.1,47.85 64.47,47.85 60.3,47.85 58.9,49.25 46,49.25 | v23.8,121.95 20.27,121.95 11.7,121.95 10.1,120.35 10.1,117.53 10.11,117.53 9.3,116.71 2.29,116.71 1.1,115.53 1.1,108.63 | 46,49.25 42.14,49.25 35.4,49.25 34,47.85 33.38,47.85 21.4,47.85 21.4,47.75 20.3,48.85 15.04,48.85 14.01,49.87 12.55,51.33 2.63,51.33 1.1,52.86 1.1,66.14 1.1,76.99 | BT1.2 44,51.25 46,49.25 | 1.1,76.99 1.1,92.78 | 1.1,92.78 1.1,108.63 | X4.3 1.1,108.63 | X5.3 1.1,92.78 | X11.3 1.1,76.99
  pour Top (isolate 0.406): -0.03,36.37 85.01,36.37 85.01,130.15 -0.03,130.15 -0.03,81.76 30.56,81.76 30.56,52.81 30.61,52.76 0.08,52.76 0.03,52.81
  pour Bottom (isolate 0.406): -0.1,36.42 85.01,36.42 85.01,130.25 -0.1,130.25 -0.1,82.37 -0.03,82.3 -0.03,81.81 30.61,81.81 30.61,52.81 0.08,52.81 -0.03,52.91
GND2  (via drill 0.38)
  Top 0.305: Q4.2 32.72,44.86 32.63,44.86
  Top 0.61: v29.81,50.58 29.07,49.85 29.07,47.48 30.63,45.92 31.29,45.92 32.36,44.86 32.63,44.86 | 54.14,44.86 53.78,44.86 52.72,45.92 52.63,45.92 49.78,48.77 v49.78,50.28 | 54.14,44.86 54.23,44.86 | 75.56,44.86 75.92,44.86 | 75.56,44.86 74.5,45.92 72.81,45.92 v68.54,50.19 | Q3.2 75.62,44.8 75.56,44.86 | Q2.2 54.14,44.86 | Q1.2 10.67,44.8 9.5,45.97 9.11,45.97 9.11,53.26 | X9.2 6.33,56.45 9.12,56.45 | 9.12,56.45 J28CA4.A 18.75,56.45 J28CA5.A 22.13,56.5 C12.C 26.25,57.22 J28CA6.A | 9.12,56.45 9.11,56.44 9.11,53.26 | v10.77,53.29 9.14,53.29 9.11,53.26
  Bottom 0.305: 33.06,52.5 33.06,52.49
  Bottom 0.61: v68.54,50.19 68.45,50.28 v49.78,50.28 49.78,52.79 47.19,55.38 35.95,55.38 33.06,52.49 31.15,50.58 v29.81,50.58 29.76,50.53 16.37,50.53 14.17,52.73 11.25,52.73 10.77,53.21 v10.77,53.29
IO0  (via drill 0.4)
  Top 0.406: v74.2,120.05 0.1UF.2 72.9,118.39 72.19,117.68 Q6.3 71.2,117.65 v74.5,117.65 | ANT1.25 52.85,103.24 55.25,100.84 R12.1 55.71,99.34 58.88,99.34 59.31,99.77 59.31,100.66 59.7,101.05 65.1,101.05 66.35,99.8 C9.1 67.3,99.85 v67.3,101.05 | v70.2,101.05 70.2,100.65 70.9,99.95 72.1,99.95 72.5,100.35 v72.5,102.15
  Bottom 0.305: v72.5,102.15 72.5,113.09 73.94,114.53 73.94,117.09 v74.5,117.65
  Bottom 0.406: FLASH_SW.3 73.26,127.81 72.8,127.35 72.8,121.45 v74.2,120.05 | v67.3,101.05 v70.2,101.05 | v72.5,102.15 72.51,102.15
IO2  (via drill 0.38, 0.4)
  Top 0.406: R16.2 70.75,90.3 70.03,89.59 70.03,87.73 73.08,84.68 73.08,80.91 71.19,79.02 IO2_SW.1 69.59,79.04 67.28,79.04 66.52,79.81 v66.52,82.88 | v50.07,102.32 ANT1.24
  Bottom 0.406: v50.07,102.32 50.07,101.52 55.58,96.01 55.58,86.26 56.41,85.42 64.95,85.42 66.55,83.82 66.52,83.79 v66.52,82.88
IO4  (via drill 0.4)
  Top 0.406: ANT1.26 v49.68,106.32 | R23.1 22.46,42.05 21.67,42.85 21.67,46.79 22.48,47.6 24.74,47.6 28.7,51.56 41.27,51.56 | R11.2 40.73,40.02 41.27,40.56 41.27,51.56 | v48.64,65.51 47.17,65.51 46,64.34 46,59.56 41.27,54.84 41.27,51.56
  Bottom 0.406: v48.64,65.51 48.64,82.09 51.08,84.53 51.08,98.02 49.1,100 49.1,103.86 49.66,104.42 49.66,106.3 v49.68,106.32
IO11  (via drill 0.38)
  Top 0.406: v59.49,77.27 59.49,82.25 58.93,82.81 R27.2 v58.01,83.97 | ANT1.19 43.72,105.94 43.71,105.94 v43.71,106.02 | v50.14,97.1 52.02,97.1 v52.07,97.05
  Bottom 0.305: 53.68,96.49 53.7,96.51 53.8,96.34
  Bottom 0.406: IO11_SW.1 67.36,73.86 61.34,73.86 59.46,75.74 59.46,77.24 v59.49,77.27 | v58.01,83.97 55.75,83.97 53.8,85.93 53.8,96.34 | v43.71,106.02 45.57,104.17 45.57,98.09 45.09,97.61 45.09,96.67 45.57,96.19 47.22,96.19 48.13,97.1 v50.14,97.1 | v52.07,97.05 53.11,97.05 53.68,96.49 53.77,96.39
IO12  (via drill 0.38, 0.4)
  Top 0.406: 35.8,105 ANT1.14 | R17.2 60.36,40.12 59.56,40.92 59.56,43.05 58.78,43.84 47.29,43.84 R24.1 43.7,42.05 43.13,42.62 43.13,48.26 43.81,48.95 46.51,48.95 47.73,50.16 v47.73,62.97 | 36.01,105.13 36.98,105.13 v37.43,105.57
  Top 0.61: ANT1.14 35.92,105.05 36.01,105.13
  Bottom 0.406: v47.73,62.97 47.73,82.35 50.37,84.99 50.37,90.58 48.51,92.43 44.7,92.43 42.72,94.41 42.72,102.59 39.74,105.57 v37.43,105.57
IO13  (via drill 0.38, 0.4)
  Top 0.406: ANT1.16 40.01,103.95 40.01,103.09 41.25,101.84 v44.45,101.84 | v55.47,63.27 55.47,54.36 63.65,46.18 63.65,43.08 64.68,42.05 R31.1 69.12,43.92 72.95,43.92 73.61,43.26 76.73,43.26 77.42,43.94 80.7,43.94 81.29,43.34 81.29,41.35 82.61,40.04 | v47.23,94.94 47.31,94.94 48.67,96.3 51.91,96.3 52.54,95.67 v52.54,93.48
  Top 0.61: R20.2 82.61,40.01 82.61,40.04
  Bottom 0.406: v44.45,101.84 44.2,101.59 44.2,95.72 45.07,94.84 47.13,94.84 v47.23,94.94 | v52.54,93.48 52.46,93.41 52.46,67.04 55.47,64.03 v55.47,63.27
IO15  (via drill 0.38, 0.4)
  Top 0.406: ANT1.23 48.8,102.41 48.59,102.21 47.12,102.21 47.11,102.21 v46.56,102.21 | v45.41,106.76 42.95,109.22 39.22,109.22 39.22,115.65 v38.89,115.98
  Bottom 0.406: v46.56,102.21 46.56,105.31 45.41,106.45 v45.41,106.76 | v38.89,115.98 38.33,116.53 25.15,116.53 24.08,117.6 IO15.1
IO25  (via drill 0.38, 0.4)
  Top 0.406: v10.44,96.67 10.39,96.62 10.41,96.6 10.41,85.85 9.22,84.66 3.38,84.66 1.78,83.06 1.78,48.59 | v33.78,110.13 ANT1.10 | R7.2 16.62,40.07 16.36,40.33 16.36,42.81 14.8,44.37 13.21,44.37 12.78,44.81 12.78,47.67 11.9,48.54 v10.44,48.54 | R22.1 1.78,42.52 1.78,48.59 | v3.38,48.54 1.83,48.54 1.78,48.59
  Bottom 0.406: v10.44,96.67 10.44,112.67 12.68,114.91 16.05,114.91 16.99,113.97 34.27,113.97 35.05,113.18 35.05,110.69 34.49,110.13 v33.78,110.13 | v10.44,48.54 v3.38,48.54
IO26  (via drill 0.4)
  Top 0.406: LEDB1.C 43.7,95.15 v41.8,95.15 | ANT1.11 34.41,108.86 33.7,108.15 v33.7,106.25
  Bottom 0.406: v41.8,95.15 41.8,102.65 39.7,104.75 35.2,104.75 v33.7,106.25
IO27  (via drill 0.4)
  Top 0.406: ANT1.12 35.89,107.55 v37.7,107.55 | v49,95.05 50.7,95.05 LEDG1.C
  Bottom 0.406: v37.7,107.55 39.5,107.55 43.45,103.6 43.45,95.17 44.73,93.88 47.83,93.88 v49,95.05
IO32  (via drill 0.38, 0.4)
  Top 0.305: ANT1.8 35.83,112.65 v33.76,112.65
  Top 0.61: v30.25,97.03 v30.25,94.16
  Bottom 0.305: 30.25,99.29 30.25,110.67
  Bottom 0.61: v33.76,112.65 32.23,112.65 30.25,110.67 v30.25,97.03 | v30.25,94.16 29.16,93.07 14.61,93.07 11.98,90.44 11.98,84.31 9.73,82.07 X11.2
IO33  (via drill 0.38)
  Top 0.305: ANT1.9
  Top 0.406: ANT1.9 37.72,111.4 38.2,111.89 38.2,115.21 v38.18,115.24
  Bottom 0.406: v38.18,115.24 37.57,115.85 19,115.85 17.73,117.12 IO33.1
IO36  (via drill 0.38)
  Top 0.356: v31.77,117.35 33.5,117.35 33.91,117.75 ANT1.4
  Top 0.406: v15.04,113.87 27.05,113.87 28.37,115.19 v28.37,117.35 | v11.79,111.38 7.7,111.38 X4.2
  Bottom 0.356: v31.77,117.35 v28.37,117.35
  Bottom 0.406: v15.04,113.87 12.55,111.38 v11.79,111.38
IO39  (via drill 0.4)
  Top 0.305: ANT1.5 34.62,116.48 33.83,115.7 v33.83,114.88
  Bottom 0.305: v33.83,114.88 17.7,114.88 16.79,115.8 12.42,115.8 9.42,112.8 9.42,99.76 7.52,97.86 X5.2
K1CM
  Bottom 1.676: X2.1 9.99,8.85 K1.C
K1NC
  Bottom 1.676: X2.2 17,18.55 K1.NC
K1NO
  Top 1.676: X2.3 22.08,9.97 18.6,13.45 10.1,13.45 K1.NO
K2CM
  Bottom 1.676: X12.1 28.92,13.77 31.75,16.6 K4.C
K2NC
  Bottom 1.676: X12.2 34,12.15 37.75,15.9 K4.NC
K2NO
  Top 1.676: X12.3 39.08,11.17 30.7,19.55 K4.NO
K3CM
  Bottom 1.676: X6.1 45.92,10.97 53.25,18.3 K2.C
K3NC
  Bottom 1.676: X6.2 51,9.35 59.25,17.6 K2.NC
K3NO
  Top 1.676: X6.3 56.08,14.87 51.4,19.55 K2.NO
K4CM
  Bottom 1.651: 71.11,16.63 66.62,16.63 62.89,12.9 62.89,6.95 X8.1
  Bottom 1.676: 71.11,16.63 75,20.52 K3.C
K4NC
  Bottom 1.676: X8.2 68,11.75 69.9,13.65 79.3,13.65 81,15.35 K3.NC
K4NO
  Top 1.676: X8.3 73.08,15.47 K3.NO
MISO  (via drill 0.38)
  Top 0.406: 52.9,112.6 53.87,112.6 v54.41,112.06 | v51.89,102.88 50.94,103.83 50.94,105.22 50.67,105.49 49.12,105.49 v48.36,106.25 | v45.39,87.49 45.36,87.52 45.36,96.33 v46.08,97.04
  Top 0.61: ANT1.31 52.9,112.63 52.9,112.6
  Bottom 0.406: v54.41,112.06 51.89,109.55 v51.89,102.88 | v48.36,106.25 47.9,105.79 47.9,98.87 v46.08,97.04 | v45.39,87.49 45.47,87.41 45.47,71.67 44.02,70.22 44.02,63.35 51.58,55.79 80.72,55.79 81.43,56.5 81.43,58.37 80.28,59.52 IDC10.5
MOSI  (via drill 0.38)
  Top 0.406: v58.32,121.75 56.9,120.33 52.9,120.33 ANT1.37 | v71.03,122.47 71.03,123.35 73.1,125.42 75.58,125.42 78.64,128.49 82.41,128.49 84.37,126.53 84.37,61.48 v83.66,60.77
  Bottom 0.406: v58.32,121.75 70.32,121.75 v71.03,122.47 | v83.66,60.77 78.94,60.77 77.79,59.61 IDC10.6
N$1  (via drill 0.4)
  Top 0.813: Q1.3 10.01,46.89 10.96,46.89 11.44,47.37 v11.62,47.37
  Bottom 0.813: K1.2 21.6,37.35 21.6,43.28 17.51,47.37 v11.62,47.37
N$2  (via drill 0.4)
  Top 0.254: ICTOUART.9 64.5,109.15 64.8,109.45 v67.2,109.45 | v71.5,108.55 R6.1
  Bottom 0.254: v67.2,109.45 67.8,109.45 68.7,108.55 v71.5,108.55
N$3  (via drill 0.4)
  Top 0.305: ICTOUART.8 67.66,108.41 69.9,110.65 70.6,110.65 71,111.05 R4.2 v74.3,112.05 | v72.5,96.45 72,96.45 71.7,96.15 71.7,95.1 R3.1
  Bottom 0.305: v74.3,112.05 74.3,102.55 72.5,100.75 v72.5,96.45
N$4
  Top 0.61: LEDR2.A R2.2
N$5
  Top 0.813: R10.1 28.55,45.8 29.55,44.8 Q4.1
N$6
  Top 0.305: ICTOUART.11 63.5,109.75 63.1,110.15 59.6,110.15 59,110.75 R5.2
N$7  (via drill 0.4)
  Top 0.406: Q5.1 58.05,114.6 58.6,114.05 v59.9,114.05 | R8.1 v65,114.05
  Bottom 0.406: v59.9,114.05 v65,114.05
N$8
  Top 0.813: R18.1 6.95,45.8 7.95,44.8 Q1.1
N$9
  Top 0.813: R19.1 49.95,45.8 50.95,44.8 Q2.1
N$10
  Top 0.305: Q6.1 69.11,116.68 69.11,119.23 68.29,120.05 R9.1
N$11  (via drill 0.4)
  Top 0.813: v44.4,45.85 46.2,45.85 R19.2
  Bottom 0.813: OK3.3 55.97,39.78 49.9,45.85 v44.4,45.85
N$12  (via drill 0.4)
  Top 0.61: 2.95,45.75 2.95,44.4 3.4,43.95 v4,43.95
  Top 0.813: R18.2 2.95,45.75
  Bottom 0.813: v4,43.95 10.25,43.95 13.81,40.39 OK1.3
N$13
  Top 0.406: 51.31,76.53 U3.1 51.38,81.33 52.91,82.86 32.768KHZ.2
N$14
  Top 0.61: R14.1 LEDB1.A
N$15
  Top 0.61: LEDR1.A 64.72,92.98 R1.2
N$16  (via drill 0.4)
  Top 0.508: v58.2,47.45 53.8,47.45 Q2.3
  Bottom 0.813: K2.2 60.6,33.1 60.6,43.35 58.2,45.75 v58.2,47.45
N$17
  Top 0.406: 32.768KHZ.1 54.31,77.4 52.1,75.2 U3.2
N$18
  Top 0.406: 51.32,73.99 U3.3 45.02,73.93 BT1.1
N$19
  Top 0.61: LEDG1.A R15.1
N$20
  Top 0.762: R11.1 39.83,44.77 LEDO2.A
N$21  (via drill 0.4)
  Top 0.813: R10.2 24.7,45.85 v22.9,45.85
  Bottom 0.813: v22.9,45.85 28.62,45.85 34.69,39.78 OK2.3
N$22
  Top 0.762: LEDO3.A 60.33,45.8 60.36,45.83 61.37,44.83 R17.1
N$23  (via drill 0.4)
  Top 0.61: Q4.3 31.75,48.25 32.14,48.63 34.7,48.63 v35.68,47.65
  Bottom 0.813: K4.2 39.7,33.7 39.7,46.53 38.58,47.65 v35.68,47.65
N$24
  Top 0.813: R21.1 71.65,45.8 72.65,44.8 Q3.1
N$25
  Top 0.762: LEDO4.A 82.05,45.75 82.73,45.07 R20.1 82.71,41.92
N$26  (via drill 0.4)
  Top 0.813: v66,45.75 67.95,45.75 arc90 R21.2
  Bottom 0.813: v66,45.75 72.05,45.75 78.02,39.78 OK4.3
N$27  (via drill 0.4)
  Top 0.61: v79.35,47.72 77.88,47.72 77.07,46.9 Q3.3 75.14,47.04
  Bottom 0.813: v79.35,47.72 82.93,47.72 84.17,46.47 84.17,34.92 K3.2
N$28
  Top 0.61: 14.28,74.9 J28CA1.C | X3.1 7.18,73.07 12.85,73.07 J28CA1.C | U$1.1 14.28,78.86 J28CA1.C
N$29  (via drill 0.4)
  Top 0.813: v2.2,37.55 2.2,40 R22.2
  Bottom 0.813: OK1.1 6.99,42.32 7.81,41.5 7.81,37.6 2.25,37.6 v2.2,37.55
N$30  (via drill 0.4)
  Top 0.813: v45.5,38.05 R24.2
  Bottom 0.813: OK3.1 50.93,42.32 52,41.25 52,39.05 51,38.05 v45.5,38.05
N$31  (via drill 0.4)
  Top 0.813: v24,38.15 R23.2
  Bottom 0.813: OK2.1 29.53,42.32 30.7,41.15 30.7,39.05 29.8,38.15 v24,38.15
N$32  (via drill 0.4)
  Top 0.813: v67.3,38.15 67.3,40 R31.2
  Bottom 0.813: OK4.1 73.03,42.32 74.2,41.15 74.2,39.45 72.9,38.15 v67.3,38.15
N$33
  Top 0.61: 17.07,45.83 17.78,45.12 R7.1
  Top 0.762: LEDO1.A 17.05,45.82 17.07,45.83
N$34
  Top 0.61: D3.A U$1.2 18.92,78.43 J28CA2.C
N$35
  Top 0.61: 14.19,60.5 J28CA4.C | 14.57,60.97 J28CA4.C | X9.1 14.19,60.5 | 14.19,60.5 14.2,60.49 | J28CA4.C 14.15,64.61 U$2.1
N$37
  Top 0.61: D2.A 20.89,64.67 U$2.2 18.8,64.28 J28CA5.C
RTCVCC
  Top 0.61: CONNECTOR.2 37.72,82.5 36.3,82.5 35.69,81.89 35.69,72.92 38.35,70.26 57.58,70.26 59.21,71.88 59.21,75.64 58.4,76.45 56.99,76.45 U3.8
RTS  (via drill 0.4)
  Top 0.254: ICTOUART.24 63,103.05 62.8,102.85 61.4,102.85 61.1,103.15 v61.1,103.65
  Top 0.406: Q5.2 59.95,116.5 60.2,116.75 v60.9,116.75 | v63.3,120.05 R9.2
  Bottom 0.254: v61.1,103.65 61.1,111.85 61.6,112.35 65.3,112.35 65.9,112.95 65.9,114.55 62.7,117.75 61.6,117.75 61,118.35 60.9,118.35
  Bottom 0.406: v60.9,116.75 60.9,118.35 60.9,118.95 62,120.05 v63.3,120.05
RX2  (via drill 0.38)
  Top 0.406: 52.81,107.62 52.78,107.64 v49.68,107.64 | v46.76,68.16 62.52,68.16 63.26,67.42 65.02,67.42 65.73,66.71 65.73,61.72 66.95,60.5 71.94,60.5 74.08,58.37 78.23,58.37 79.12,59.26 79.12,63.53 80.23,64.63 IDC10.9
  Top 0.61: ANT1.27 52.82,107.62 52.81,107.62
  Bottom 0.406: v49.68,107.64 49.63,107.59 40.6,107.59 39.61,108.58 34.94,108.58 32.94,106.59 32.94,105.88 35.12,103.71 39.92,103.71 40.98,102.64 40.98,94.11 47.12,87.97 47.12,82.64 46.94,82.46 46.94,68.34 v46.76,68.16
RXD0  (via drill 0.4)
  Top 0.254: ICTOUART.26 64,102.06 63.59,101.65 58.47,101.65 56.03,104.09 56.03,115.22 v54.8,116.45 52.88,116.45 ANT1.34
  Top 0.406: v29.6,121.25 v29.6,123.05
  Bottom 0.254: v54.8,116.45 51.3,116.45 50.6,117.15 36.7,117.15 | v29.6,123.05 26,123.05 25.2,123.85 20.2,123.85
  Bottom 0.305: J2.3 19.44,124.61 20.2,123.85 | 36.7,117.15 36.2,117.65 33,117.65 32.4,118.25 32.4,120.55 31.7,121.25 v29.6,121.25
SCL  (via drill 0.4)
  Top 0.305: ANT1.36 56.73,119.02 v57.7,118.05 | v73.82,113.19 62.64,113.19 v62.5,113.05 | v52.76,101.93 v52.75,101.93 50.62,99.8 R26.1 | U3.6 56.9,73.93 56.81,73.93 56.66,73.95
  Top 0.406: 56.66,73.95 v54.64,73.95 | v75.8,79.75 75.8,87.47 76.5,88.17 X10.4 80.88,88.17 82.86,90.14 82.86,106.61 80.3,109.17 X7.4 | v74.5,71.55 74.5,62.79 75.21,62.08 77.72,62.08 IDC10.8
  Bottom 0.305: v57.7,118.05 57.7,117.15 58.8,116.05 58.8,113.75 59.5,113.05 | 59.5,113.05 v62.5,113.05 | v73.82,113.19 74.42,113.19 75.5,112.11 75.5,109.95 76.28,109.17 X7.4 | 59.5,113.05 59.5,102.68 58.76,101.93 v52.76,101.93
  Bottom 0.406: X10.4 76.22,88.17 74.7,86.65 74.7,81.89 61.25,81.89 54.64,75.27 v54.64,73.95 | v74.5,71.55 74.5,78.45 v75.8,79.75
SDA  (via drill 0.38, 0.4)
  Top 0.305: U3.5 54.63,72.66 v54.59,72.7
  Top 0.406: R25.1 43.55,99.8 45.1,101.35 50.5,101.35 v51.1,101.95 | v51.1,115.25 52.81,115.25 ANT1.33 | v70.3,97.85 v75.3,97.85 | v54.59,72.71 v54.59,72.7 | 57.06,72.66 U3.5
  Top 0.508: v82.4,83.21 79.75,83.21 X10.3
  Bottom 0.406: v82.4,83.21 82.38,83.23 82.38,102.59 80.87,104.09 X7.3 76.84,104.09 75.3,102.55 v75.3,97.85 | v82.4,83.21 82.38,83.19 | v70.3,97.85 70.3,98.95 69.3,99.95 66.8,99.95 65.66,101.09 51.96,101.09 v51.1,101.95 v51.1,115.25 | X10.3 77.39,83.09 75.2,80.91 61.6,80.91 55.6,74.91 55.6,73.72 v54.59,72.7 | IDC10.7 79.33,62.09 78.2,63.22 76.71,63.22 76.15,63.78 76.15,65.6 76.9,66.35 81.05,66.35 82.4,67.7 v82.4,83.21
SPICLK
  Top 0.406: ANT1.13 35.88,106.35
TX2  (via drill 0.38)
  Top 0.406: 52.9,108.86 53.61,108.86 v55.3,110.55 | v76.54,119.8 v75.12,118.38
  Top 0.61: ANT1.28 52.9,108.86
  Bottom 0.406: v55.3,110.55 55.3,115.8 56.9,117.4 56.9,118.38 57.78,119.27 60.36,119.27 61.96,120.87 71.03,120.87 73.43,118.47 75.03,118.47 v75.12,118.38 | v76.54,119.8 79.52,119.8 82.86,116.46 82.86,103.68 83.4,103.14 83.4,64.64 82.19,63.44 78.94,63.44 77.79,64.59 IDC10.10
TXD0  (via drill 0.4)
  Top 0.254: ICTOUART.25 63.5,102.45 63.2,102.15 58.78,102.15 56.57,104.37 56.57,115.98 v54.8,117.75 ANT1.35
  Bottom 0.305: v54.8,117.75 37,117.75 36.6,118.15 33.3,118.15 32.9,118.55 32.9,121.25 32,122.15 25.8,122.15 24.7,123.25 18.3,123.25 16.9,124.65 J2.2
USB_DN
  Top 0.305: USB.2 77.2,116.65 76.66,116.11 76.66,114.41 75.36,113.11 75.36,111.73 74.8,111.18 74.22,111.18 73.2,110.15 70.2,110.15 68.1,108.05 68.1,106.85 67.8,106.55 ICTOUART.5
USB_DP  (via drill 0.4)
  Top 0.305: v76.5,117.25 79.08,117.25 USB.3 | ICTOUART.4 68.2,106.05 68.7,106.55 68.7,107.85 70.5,109.65 73.5,109.65 74.1,110.25 75.5,110.25 76.83,111.58 v76.83,113.15
  Bottom 0.305: v76.83,113.15 75.46,114.52 75.46,116.49 76.22,117.25 v76.5,117.25
VIN  (via drill 0.38, 0.4)
  Top 0.406: v73.17,116.51 74.59,116.51 v76.54,118.47 | 71.65,93.31 70.94,94.02 64.01,94.02 59.74,89.75 59.74,86.51 | v78.68,112.33 75.98,109.64 74.28,109.64 73.4,108.75 v73.4,100.05 | v73.8,95.25 73.8,93.65 73.2,93.05 R3.2 | R2.1 59.7,86.55 59.74,86.51 | 59.74,86.51 59.85,86.4 | 59.85,86.4 60.5,85.75 60.5,71.07 58.67,69.24 37.21,69.24 34.65,71.81 34.65,90.12 32.38,92.38 | 59.83,86.37 59.85,86.4
  Top 0.61: C5.1 30.15,105.3 31.2,104.25 31.2,100.15 30.7,99.65 C1.A 27.7,99.65 26.07,101.28 REGULATOR.3 24.81,99.76 24.4,99.35 21.6,99.35 21.1,98.85 C4.A 26.27,92.38 29.25,92.38 | 29.25,92.38 32.38,92.38 37.92,86.84 37.92,85.24 CONNECTOR.3 | 25.52,78.97 D3.C | R3.2 71.75,93.21 71.65,93.31 | C7.A 23.89,74.41 J28CA3.C 27,77.28 D3.C | 29.25,92.38 29.25,82.7 D3.C
  Bottom 0.406: J2.4 21.98,126.79 23.44,125.32 30.61,125.32 35,120.93 53.03,120.93 54.53,122.43 54.53,125.48 55.19,126.14 70.83,126.14 71.8,125.17 71.8,120.95 73.6,119.15 75.87,119.15 76.54,118.48 v76.54,118.47 76.55,118.47 77.43,117.59 77.43,116.42 78.68,115.18 v78.68,112.33 | 72.45,115.26 72.45,115.8 v73.17,116.51 | v73.4,100.05 73.8,99.65 v73.8,95.25
  Bottom 0.61: D1.C 72.45,115.22 72.45,115.26
VIN2  (via drill 0.4)
  Top 0.61: v20,42.35 20,51.9 21.54,53.44 27.53,53.44 29.01,54.91 29.01,59.61 27.92,60.7 J28CA6.C | D2.C 26.11,64.62 26.87,63.86 J28CA6.C | J28CA6.C 23.54,60.7 C12.A
  Top 0.914: 12.27,42.32 OK1.4
  Top 1.016: 69.04,36.78 74.75,36.78 76.19,38.22 76.19,38.62 76.2,38.63 76.2,41.35 77.17,42.32 OK4.4 | 69.04,36.78 56.17,36.78 | 56.17,36.78 47.22,36.78 | 47.22,36.78 44.33,36.78 44.3,36.76 34.7,36.76 | 34.7,36.76 25.7,36.76 | 25.7,36.76 12.39,36.76 11.58,37.57 | 12.27,42.32 11.51,41.56 11.51,37.64 11.58,37.57 | 56.17,36.78 54.8,38.15 54.8,41.35 55.77,42.32 OK3.4 | 34.7,36.76 32.9,38.55 32.9,41.25 33.97,42.32 OK2.4 | 11.58,37.57 7.25,37.57 4,34.32 K1.1 | K4.1 25.75,36.71 25.7,36.76 | K2.1 47.25,36.75 47.22,36.78 | K3.1 69,36.74 69.04,36.78
  Bottom 0.813: v20,42.35 13.84,42.35 OK1.4

### Text on the board
tNames: TX | RX | +5V | GND | 0.1uF | 10k | 3.3V | 600mA | 10k | 600mA | 0.1uF | IO36 | 10uF | 10k | 47.5k | 0.1uF | SCL | GND | 100uF | 2k | LDO 3.3V | 10uF | SDA | 3.3V | 10k | 10k | 10k | 0.1uF | 0.1uF | 0.1uF | GND | IO39 | 10uF | 10k | Red | Red | Blue | Orange | 22.1k | 3.3V | GND | 1k | H | 10k | S | 1k | 1k | 1k | SCL | 3.3V | +5V | Fuse | SDA | IO32 | +3.3V | 10k | RB168l | GND | GND | tvs | 3.3V | DS1307 | VIN | 10uF | tvs | tvs | Fuse | GND | TX2 | RX2 | RB168l | SCL | SDA | tvs | VIN2 | MISO | MOSI | 10uF | CLK | CS/SS | GND2 | tvs | tvs | GND | +3.3V | Batterry DS1307 | 600mA | 600mA | 600mA | 600mA | 10k | Green | 10k | Green | 10k | Green | 10k | Green | 1k | 1k | 1k | 1k | 1k | 1k | 1k | 1k | PC817 | PC817 | PC817 | PC817 | Relay DC5V (IO25) | Relay DC5V (IO12) | Relay DC5V (IO13) | Relay DC5V (IO4) | COM | NC | NO | COM | NC | NO | COM | NC | NO | COM | NC | NO
bNames: ESP32 | WROOM-32 | WIFI Module | Version 1.0 | Handy Sense board | Open Innavation